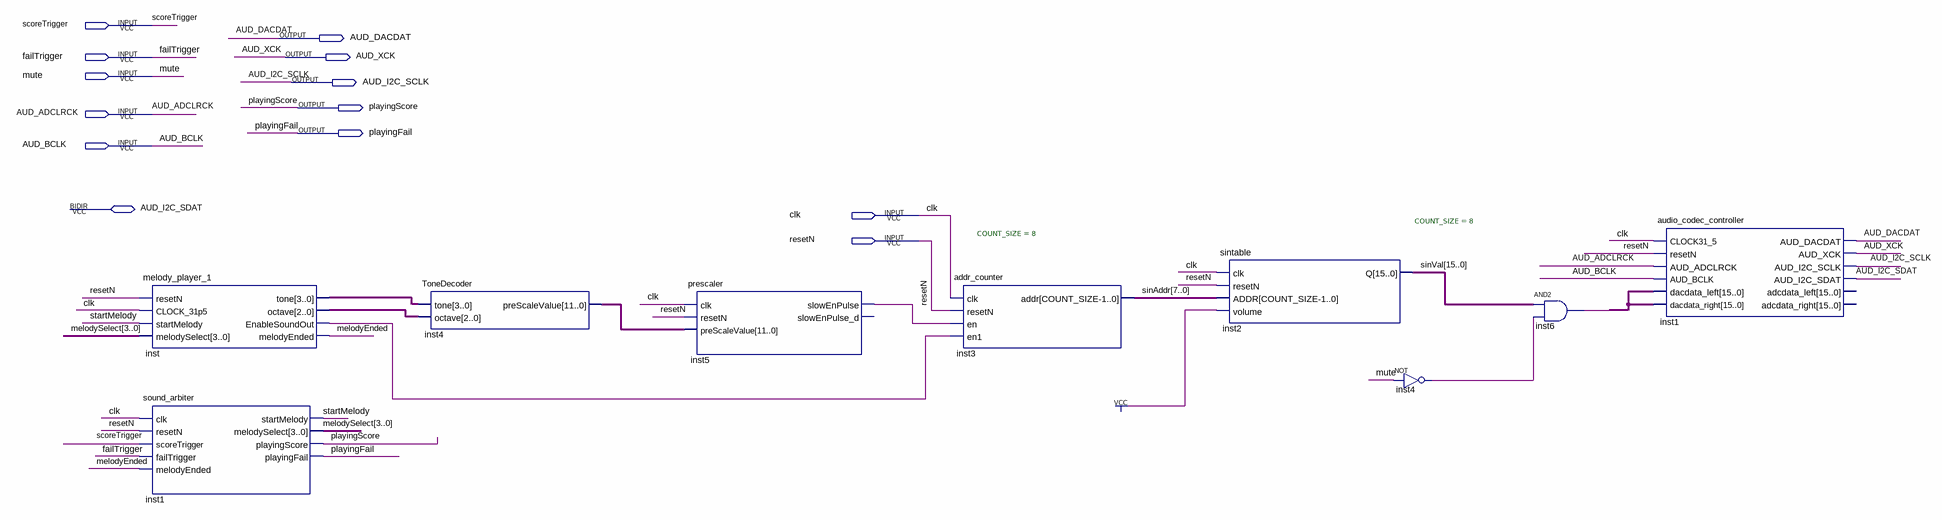
[diagram p0: schematic sheet]
// Quartus schematic Sound_Block.bdf as structural Verilog: 9 symbols, 13 pins
module Sound_Block (
  input  scoreTrigger,
  input  failTrigger,
  input  mute,
  input  AUD_ADCLRCK,
  input  AUD_BCLK,
  input  clk,
  input  resetN,
  inout  AUD_I2C_SDAT,
  output AUD_DACDAT,
  output AUD_XCK,
  output AUD_I2C_SCLK,
  output playingScore,
  output playingFail
);

  wire inst4_out, inst5_slowenpulse, inst6_out, inst_enablesoundout, melodyEnded, startMelody;
  wire [2:0] inst_octave;
  wire [3:0] inst_tone, melodySelect;
  wire [7:0] sinAddr;
  wire [11:0] inst4_prescalevalue;
  wire [15:0] sinVal, undriven;

  melody_player_1 inst (
    .resetN(resetN), .CLOCK_31p5(clk), .startMelody(startMelody), .melodySelect(melodySelect),
    .tone(inst_tone), .octave(inst_octave), .EnableSoundOut(inst_enablesoundout), .melodyEnded(melodyEnded));
  sound_arbiter inst1 (
    .clk(clk), .resetN(resetN), .scoreTrigger(scoreTrigger), .failTrigger(failTrigger),
    .melodyEnded(melodyEnded), .startMelody(startMelody), .melodySelect(melodySelect),
    .playingScore(playingScore), .playingFail(playingFail));
  ToneDecoder inst4 (.tone(inst_tone), .octave(inst_octave), .preScaleValue(inst4_prescalevalue));
  prescaler inst5 (
    .clk(clk), .resetN(resetN), .preScaleValue(inst4_prescalevalue), .slowEnPulse(inst5_slowenpulse));  // open: slowEnPulse_d
  addr_counter #(.COUNT_SIZE(8)) inst3 (
    .clk(clk), .resetN(resetN), .en(inst5_slowenpulse), .en1(inst_enablesoundout), .addr(sinAddr));
  sintable #(.COUNT_SIZE(8)) inst2 (.clk(clk), .resetN(resetN), .ADDR(sinAddr), .volume(1'b1), .Q(sinVal));
  not inst4_dup2 (inst4_out, mute);
  assign inst6_out = sinVal & {16{inst4_out}};  // AND2 inst6, 16 bits wide
  audio_codec_controller inst1_dup2 (
    .CLOCK31_5(clk), .resetN(resetN), .AUD_ADCLRCK(AUD_ADCLRCK), .AUD_BCLK(AUD_BCLK),
    .dacdata_left(undriven), .dacdata_right(undriven), .AUD_DACDAT(AUD_DACDAT), .AUD_XCK(AUD_XCK),
    .AUD_I2C_SCLK(AUD_I2C_SCLK), .AUD_I2C_SDAT(AUD_I2C_SDAT));  // open: adcdata_left, adcdata_right
endmodule
